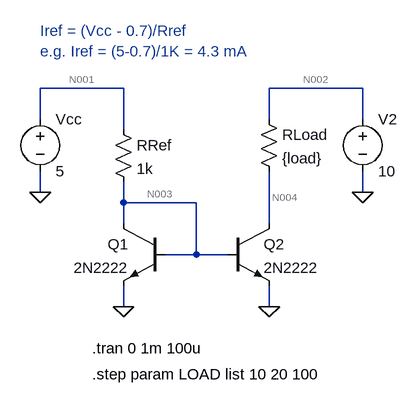
[diagram p0: schematic 01-current_mirror.asc]
01-current_mirror.asc, the LTspice schematic file:
Version 4
SHEET 1 880 680
WIRE 144 -64 16 -64
WIRE 512 -64 368 -64
WIRE 16 -16 16 -64
WIRE 368 -16 368 -64
WIRE 512 -16 512 -64
WIRE 144 0 144 -64
WIRE 16 96 16 64
WIRE 512 96 512 64
WIRE 144 112 144 80
WIRE 256 112 144 112
WIRE 144 144 144 112
WIRE 368 144 368 64
WIRE 256 192 256 112
WIRE 256 192 208 192
WIRE 304 192 256 192
WIRE 144 272 144 240
WIRE 368 272 368 240
FLAG 144 272 0
FLAG 368 272 0
FLAG 16 96 0
FLAG 512 96 0
SYMBOL npn 208 144 M0
SYMATTR InstName Q1
SYMATTR Value 2N2222
SYMBOL npn 304 144 R0
SYMATTR InstName Q2
SYMATTR Value 2N2222
SYMBOL res 128 -16 R0
SYMATTR InstName RRef
SYMATTR Value 1k
SYMBOL voltage 16 -32 R0
WINDOW 123 0 0 Left 0
WINDOW 39 0 0 Left 0
SYMATTR InstName Vcc
SYMATTR Value 5
SYMBOL voltage 512 -32 R0
SYMATTR InstName V2
SYMATTR Value 10
SYMBOL res 352 -32 R0
SYMATTR InstName RLoad
SYMATTR Value {load}
TEXT 96 336 Left 2 !.tran 0 1m 100u
TEXT 96 376 Left 2 !.step param LOAD list 10 20 100
TEXT 16 -152 Left 2 ;Iref = (Vcc - 0.7)/Rref\ne.g. Iref = (5-0.7)/1K = 4.3 mA

The netlist it stands for:
* 01-current_mirror.asc
Q1 N003 N003 0 0 2N2222
Q2 N004 N003 0 0 2N2222
RRef N001 N003 1k
Vcc N001 0 5
V2 N002 0 10
RLoad N002 N004 {load}
.model NPN NPN
.model PNP PNP
.lib standard.bjt
.tran 0 1m 100u
.step param LOAD list 10 20 100
* Iref = (Vcc - 0.7)/Rref
* e.g. Iref = (5-0.7)/1K = 4.3 mA
.backanno
.end

* Results of the author's LTspice run, read from the files saved beside the schematic
* Operating Point (first step), zero values left out:
*   load = 10 
*   V(n003) = 694.1 mV
*   V(n004) = 9.954 V
*   V(n001) = 5 V
*   V(n002) = 10 V
*   Ic(Q1) = 4.263 mA
*   Ib(Q1) = 21.62 µA
*   Ie(Q1) = -4.284 mA
*   Ic(Q2) = 4.644 mA
*   Ib(Q2) = 21.55 µA
*   Ie(Q2) = -4.666 mA
*   I(Rref) = 4.306 mA
*   I(Rload) = 4.644 mA
*   I(Vcc) = -4.306 mA
*   I(V2) = -4.644 mA
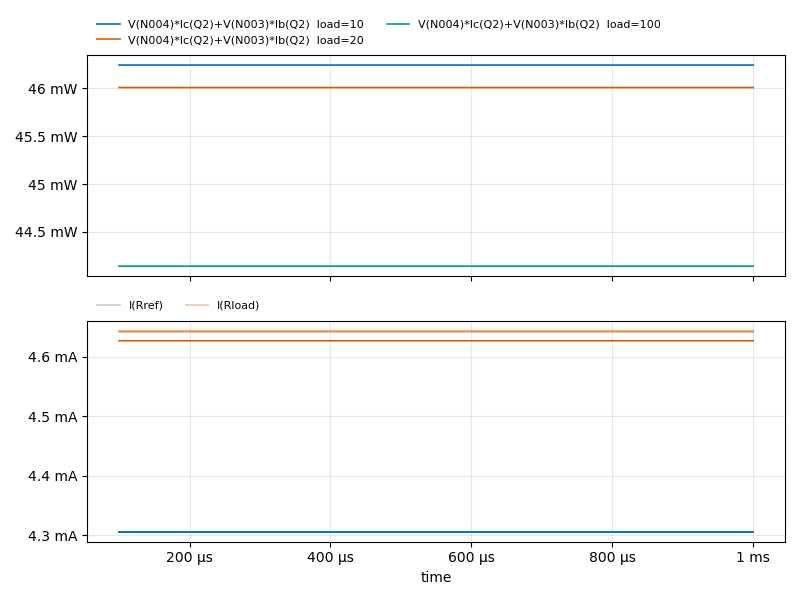
[diagram p1: Transient Analysis of 01-current_mirror.asc, plotted from the saved traces]
* Transient Analysis, 3 runs:
*   V(N004)*Ic(Q2)+V(N003)*Ib(Q2) [load=10]: min 46.24 mW, max 46.24 mW, average 46.24 mW, rms 46.24 mW, last 46.24 mW
*   V(N004)*Ic(Q2)+V(N003)*Ib(Q2) [load=20]: min 46.01 mW, max 46.01 mW, average 46.01 mW, rms 46.01 mW, last 46.01 mW
*   V(N004)*Ic(Q2)+V(N003)*Ib(Q2) [load=100]: min 44.14 mW, max 44.14 mW, average 44.14 mW, rms 44.14 mW, last 44.14 mW
*   I(Rref) [load=10]: min 4.306 mA, max 4.306 mA, average 4.306 mA, rms 4.306 mA, last 4.306 mA
*   I(Rref) [load=20]: min 4.306 mA, max 4.306 mA, average 4.306 mA, rms 4.306 mA, last 4.306 mA
*   I(Rref) [load=100]: min 4.306 mA, max 4.306 mA, average 4.306 mA, rms 4.306 mA, last 4.306 mA
*   I(Rload) [load=10]: min 4.644 mA, max 4.644 mA, average 4.644 mA, rms 4.644 mA, last 4.644 mA
*   I(Rload) [load=20]: min 4.642 mA, max 4.642 mA, average 4.642 mA, rms 4.642 mA, last 4.642 mA
*   I(Rload) [load=100]: min 4.627 mA, max 4.627 mA, average 4.627 mA, rms 4.627 mA, last 4.627 mA